# Altium schematic sheet Top_Level.SchDoc
size A
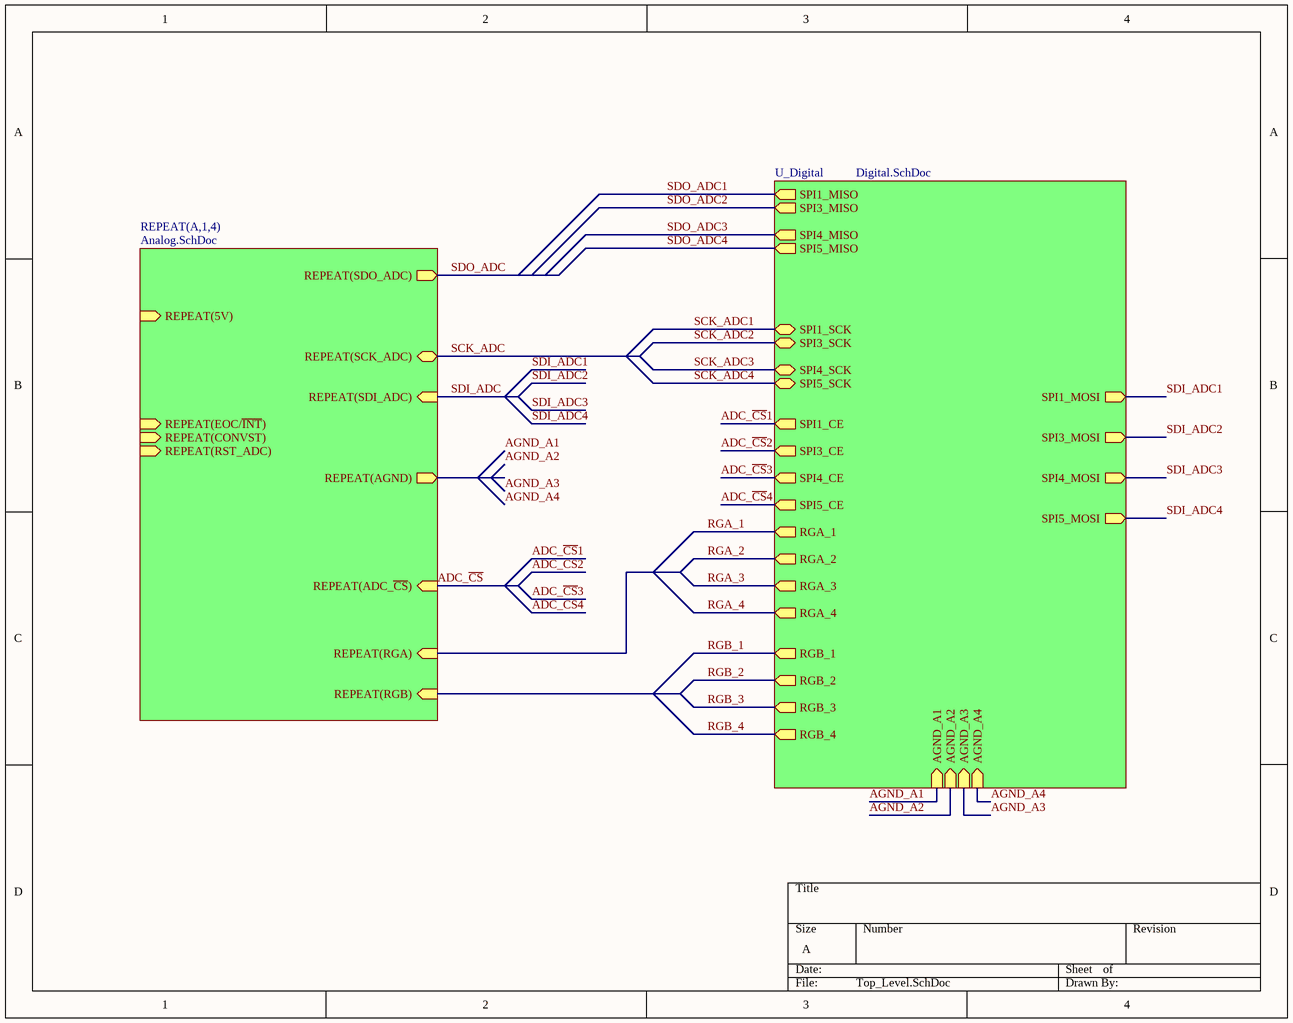
[diagram p0: Top_Level.SchDoc]

## Sub-sheets
REPEAT(A,1,4) = Analog.SchDoc: REPEAT(SCK_ADC) (bidir), REPEAT(SDO_ADC) (out), REPEAT(SDI_ADC) (in), REPEAT(ADC_~{CS}) (in), REPEAT(EOC/~{INT}) (in), REPEAT(CONVST) (in), REPEAT(RST_ADC) (in), REPEAT(5V) (in), REPEAT(AGND) (out), REPEAT(RGA) (in), REPEAT(RGB) (in)
U_Digital = Digital.SchDoc: SPI1_SCK (bidir), SPI3_SCK (bidir), SPI4_SCK (bidir), SPI5_SCK (bidir), SPI1_MISO (out), SPI1_MOSI (out), SPI3_MISO (out), SPI3_MOSI (out), SPI4_MISO (out), SPI4_MOSI (out), SPI5_MISO (out), SPI5_MOSI (out), SPI1_CE (out), SPI3_CE (out), SPI4_CE (out), SPI5_CE (out), AGND_A1 (in), AGND_A2 (in), AGND_A3 (in), AGND_A4 (in), RGA_1 (out), RGA_2 (out), RGB_1 (out), RGB_2 (out), RGA_3 (out), RGA_4 (out), RGB_3 (out), RGB_4 (out)

## Nets
ADC_~{CS}: sheet REPEAT(A,1,4)/REPEAT(ADC_~{CS})
ADC_~{CS}1: sheet U_Digital/SPI1_CE
ADC_~{CS}2: sheet U_Digital/SPI3_CE
ADC_~{CS}3: sheet U_Digital/SPI4_CE
ADC_~{CS}4: sheet U_Digital/SPI5_CE
AGND_A1: sheet U_Digital/AGND_A1
AGND_A2: sheet U_Digital/AGND_A2
AGND_A3: sheet U_Digital/AGND_A3
AGND_A4: sheet U_Digital/AGND_A4
RGA_1: sheet U_Digital/RGA_1
RGA_2: sheet U_Digital/RGA_2
RGA_3: sheet U_Digital/RGA_3
RGA_4: sheet U_Digital/RGA_4
RGB_1: sheet U_Digital/RGB_1
RGB_2: sheet U_Digital/RGB_2
RGB_3: sheet U_Digital/RGB_3
RGB_4: sheet U_Digital/RGB_4
SCK_ADC: sheet REPEAT(A,1,4)/REPEAT(SCK_ADC)
SCK_ADC1: sheet U_Digital/SPI1_SCK
SCK_ADC2: sheet U_Digital/SPI3_SCK
SCK_ADC3: sheet U_Digital/SPI4_SCK
SCK_ADC4: sheet U_Digital/SPI5_SCK
SDI_ADC: sheet REPEAT(A,1,4)/REPEAT(SDI_ADC)
SDI_ADC1: sheet U_Digital/SPI1_MOSI
SDI_ADC2: sheet U_Digital/SPI3_MOSI
SDI_ADC3: sheet U_Digital/SPI4_MOSI
SDI_ADC4: sheet U_Digital/SPI5_MOSI
SDO_ADC: sheet REPEAT(A,1,4)/REPEAT(SDO_ADC)
SDO_ADC1: sheet U_Digital/SPI1_MISO
SDO_ADC2: sheet U_Digital/SPI3_MISO
SDO_ADC3: sheet U_Digital/SPI4_MISO
SDO_ADC4: sheet U_Digital/SPI5_MISO

## Notes on the sheet
- Labels drawn without touching a wire or pin: AGND_A2, AGND_A3